# Altium schematic sheet NB2_DB.SchDoc
size A3
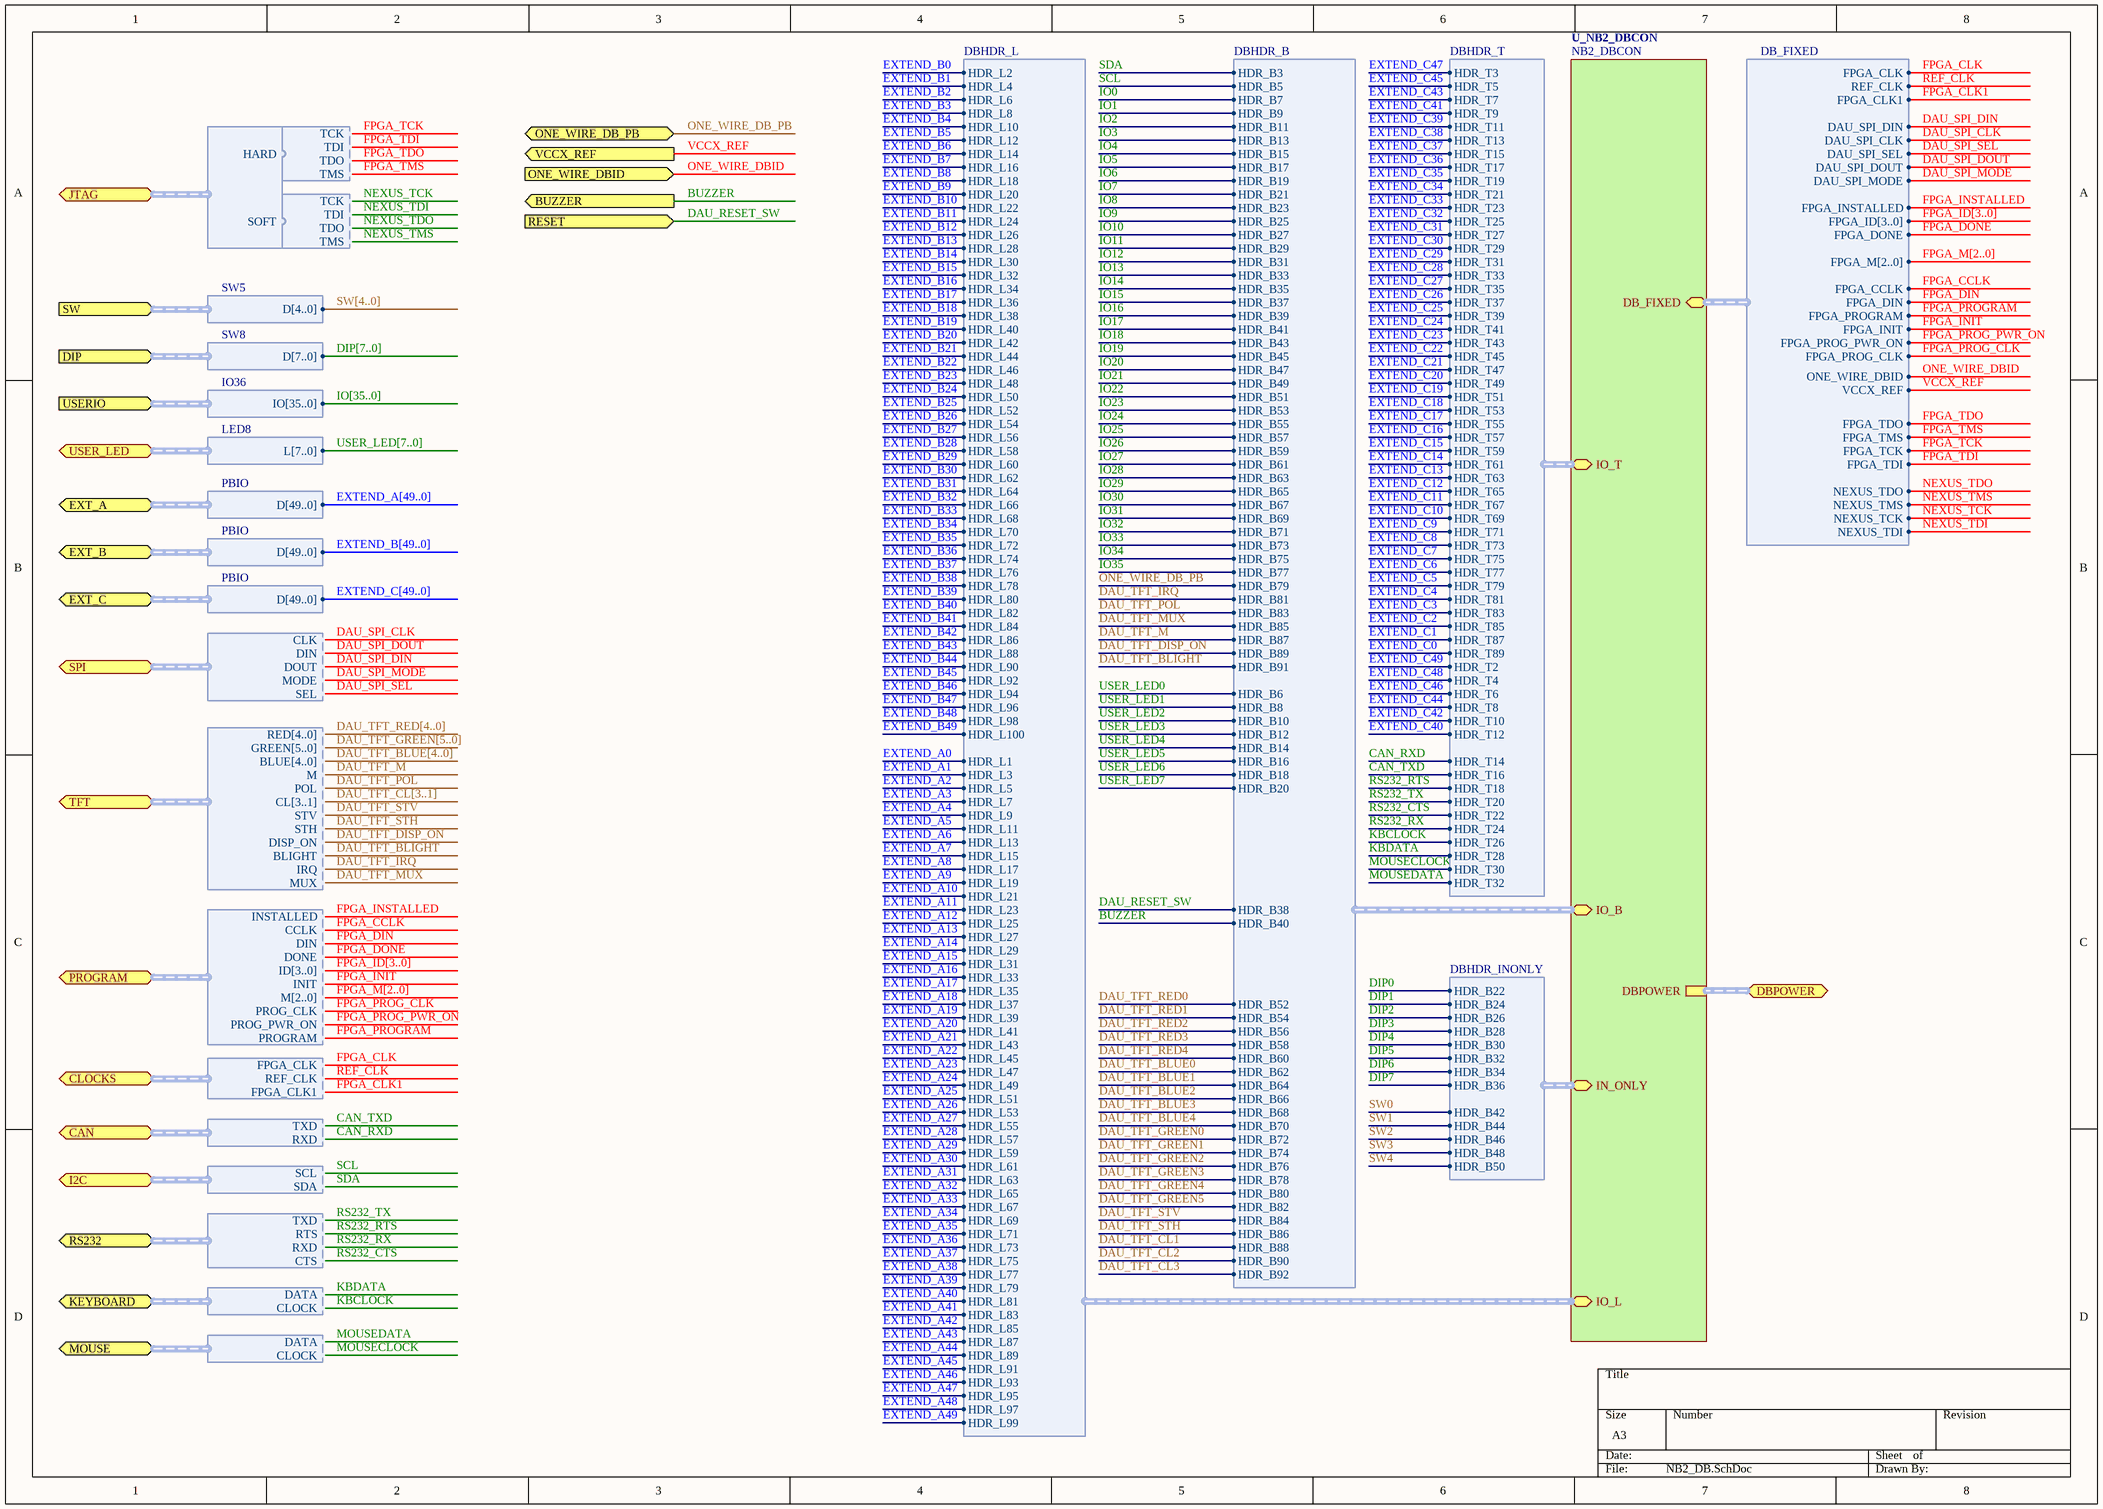
[diagram p0: NB2_DB.SchDoc]

## Sub-sheets
U_NB2_DBCON = NB2_DBCON: DBPOWER (harness DBPOWER), IO_B (harness DBHDR_B), DB_FIXED (harness DB_FIXED), IO_T (harness DBHDR_T), IN_ONLY (harness DBHDR_INONLY), IO_L (harness DBHDR_L)

## Ports
BUZZER (out), CAN (harness CAN_INT), CLOCKS (harness DAU_CLK), DBPOWER, DIP (harness SW8), EXT_A (harness PBIO), EXT_B (harness PBIO), EXT_C (harness PBIO), I2C (harness I2C), JTAG (harness HardSoft_JTAG), KEYBOARD (harness PS2), MOUSE (harness PS2), ONE_WIRE_DB_PB (bidir), ONE_WIRE_DBID (in), PROGRAM (harness DAU_CTRL), RESET (in), RS232 (harness RS232_INT), SPI (harness DAU_SPI), SW (harness SW5), TFT (harness DAU_TFT), USER_LED (harness LED8), USERIO (harness IO36), VCCX_REF (out)

## Harnesses
JTAG: TMS, TDO, TDI, TCK
HardSoft_JTAG: HARD, SOFT
LED8: L[7..0]
IO36: IO[35..0]
SW8: D[7..0]
SW5: D[4..0]
PBIO: D[49..0]
DAU_CLK: REF_CLK, FPGA_CLK, FPGA_CLK1
DAU_SPI: MODE, SEL, CLK, DIN, DOUT
DAU_CTRL: DIN, DONE, INSTALLED, ID[3..0], CCLK, PROGRAM, M[2..0], INIT, PROG_PWR_ON, PROG_CLK
DAU_TFT: RED[4..0], GREEN[5..0], BLUE[4..0], M, POL, CL[3..1], STV, STH, DISP_ON, BLIGHT, IRQ, MUX
PS2: DATA, CLOCK
CAN_INT: TXD, RXD
I2C: SCL, SDA
RS232_INT: RXD, TXD, RTS, CTS
DBHDR_B: HDR_B3, HDR_B5, HDR_B7, HDR_B9, HDR_B11, HDR_B13, HDR_B15, HDR_B17, HDR_B19, HDR_B21, HDR_B23, HDR_B25, HDR_B27, HDR_B29, HDR_B31, HDR_B33, HDR_B35, HDR_B37, HDR_B39, HDR_B41, HDR_B43, HDR_B45, HDR_B47, HDR_B49, HDR_B51, HDR_B53, HDR_B55, HDR_B57, HDR_B59, HDR_B61, HDR_B63, HDR_B65, HDR_B67, HDR_B69, HDR_B71, HDR_B73, HDR_B75, HDR_B77, HDR_B79, HDR_B81, HDR_B83, HDR_B85, HDR_B87, HDR_B89, HDR_B91, HDR_B6, HDR_B8, HDR_B10, HDR_B12, HDR_B14, HDR_B16, HDR_B18, HDR_B20, HDR_B38, HDR_B40, HDR_B52, HDR_B54, HDR_B56, HDR_B58, HDR_B60, HDR_B62, HDR_B64, HDR_B66, HDR_B68, HDR_B70, HDR_B72, HDR_B74, HDR_B76, HDR_B78, HDR_B80, HDR_B82, HDR_B84, HDR_B86, HDR_B88, HDR_B90, HDR_B92
DBHDR_T: HDR_T3, HDR_T5, HDR_T7, HDR_T9, HDR_T11, HDR_T13, HDR_T15, HDR_T17, HDR_T19, HDR_T21, HDR_T23, HDR_T25, HDR_T27, HDR_T29, HDR_T31, HDR_T33, HDR_T35, HDR_T37, HDR_T39, HDR_T41, HDR_T43, HDR_T45, HDR_T47, HDR_T49, HDR_T51, HDR_T53, HDR_T55, HDR_T57, HDR_T59, HDR_T61, HDR_T63, HDR_T65, HDR_T67, HDR_T69, HDR_T71, HDR_T73, HDR_T75, HDR_T77, HDR_T79, HDR_T81, HDR_T83, HDR_T85, HDR_T87, HDR_T89, HDR_T2, HDR_T4, HDR_T6, HDR_T8, HDR_T10, HDR_T12, HDR_T14, HDR_T16, HDR_T18, HDR_T20, HDR_T22, HDR_T24, HDR_T26, HDR_T28, HDR_T30, HDR_T32
DBHDR_L: HDR_L2, HDR_L4, HDR_L6, HDR_L8, HDR_L10, HDR_L12, HDR_L14, HDR_L16, HDR_L18, HDR_L20, HDR_L22, HDR_L24, HDR_L26, HDR_L28, HDR_L30, HDR_L32, HDR_L34, HDR_L36, HDR_L38, HDR_L40, HDR_L42, HDR_L44, HDR_L46, HDR_L48, HDR_L50, HDR_L52, HDR_L54, HDR_L56, HDR_L58, HDR_L60, HDR_L62, HDR_L64, HDR_L66, HDR_L68, HDR_L70, HDR_L72, HDR_L74, HDR_L76, HDR_L78, HDR_L80, HDR_L82, HDR_L84, HDR_L86, HDR_L88, HDR_L90, HDR_L92, HDR_L94, HDR_L96, HDR_L98, HDR_L100, HDR_L1, HDR_L3, HDR_L5, HDR_L7, HDR_L9, HDR_L11, HDR_L13, HDR_L15, HDR_L17, HDR_L19, HDR_L21, HDR_L23, HDR_L25, HDR_L27, HDR_L29, HDR_L31, HDR_L33, HDR_L35, HDR_L37, HDR_L39, HDR_L41, HDR_L43, HDR_L45, HDR_L47, HDR_L49, HDR_L51, HDR_L53, HDR_L55, HDR_L57, HDR_L59, HDR_L61, HDR_L63, HDR_L65, HDR_L67, HDR_L69, HDR_L71, HDR_L73, HDR_L75, HDR_L77, HDR_L79, HDR_L81, HDR_L83, HDR_L85, HDR_L87, HDR_L89, HDR_L91, HDR_L93, HDR_L95, HDR_L97, HDR_L99
DBHDR_INONLY: HDR_B22, HDR_B24, HDR_B26, HDR_B28, HDR_B30, HDR_B32, HDR_B34, HDR_B36, HDR_B42, HDR_B44, HDR_B46, HDR_B48, HDR_B50
DB_FIXED: DAU_SPI_CLK, DAU_SPI_DIN, DAU_SPI_DOUT, NEXUS_TMS, NEXUS_TDI, NEXUS_TDO, NEXUS_TCK, ONE_WIRE_DBID, FPGA_INSTALLED, FPGA_PROG_CLK, DAU_SPI_SEL, DAU_SPI_MODE, FPGA_PROG_PWR_ON, FPGA_DONE, FPGA_CCLK, FPGA_PROGRAM, FPGA_DIN, FPGA_INIT, FPGA_TDO, FPGA_TDI, FPGA_TCK, FPGA_TMS, FPGA_CLK1, FPGA_ID[3..0], FPGA_M[2..0], VCCX_REF, FPGA_CLK, REF_CLK

## Nets
BUZZER: port BUZZER, sheet U_NB2_DBCON/IO_B.HDR_B40
CAN_RXD: port CAN.RXD, sheet U_NB2_DBCON/IO_T.HDR_T14
CAN_TXD: port CAN.TXD, sheet U_NB2_DBCON/IO_T.HDR_T16
DAU_RESET_SW: port RESET, sheet U_NB2_DBCON/IO_B.HDR_B38
DAU_SPI_CLK: port SPI.CLK, sheet U_NB2_DBCON/DB_FIXED.DAU_SPI_CLK
DAU_SPI_DIN: port SPI.DOUT, sheet U_NB2_DBCON/DB_FIXED.DAU_SPI_DIN
DAU_SPI_DOUT: port SPI.DIN, sheet U_NB2_DBCON/DB_FIXED.DAU_SPI_DOUT
DAU_SPI_MODE: port SPI.MODE, sheet U_NB2_DBCON/DB_FIXED.DAU_SPI_MODE
DAU_SPI_SEL: port SPI.SEL, sheet U_NB2_DBCON/DB_FIXED.DAU_SPI_SEL
DAU_TFT_BLIGHT: port TFT.BLIGHT, sheet U_NB2_DBCON/IO_B.HDR_B91
DAU_TFT_BLUE0: sheet U_NB2_DBCON/IO_B.HDR_B62
DAU_TFT_BLUE1: sheet U_NB2_DBCON/IO_B.HDR_B64
DAU_TFT_BLUE2: sheet U_NB2_DBCON/IO_B.HDR_B66
DAU_TFT_BLUE3: sheet U_NB2_DBCON/IO_B.HDR_B68
DAU_TFT_BLUE4: sheet U_NB2_DBCON/IO_B.HDR_B70
DAU_TFT_CL1: sheet U_NB2_DBCON/IO_B.HDR_B88
DAU_TFT_CL2: sheet U_NB2_DBCON/IO_B.HDR_B90
DAU_TFT_CL3: sheet U_NB2_DBCON/IO_B.HDR_B92
DAU_TFT_DISP_ON: port TFT.DISP_ON, sheet U_NB2_DBCON/IO_B.HDR_B89
DAU_TFT_GREEN0: sheet U_NB2_DBCON/IO_B.HDR_B72
DAU_TFT_GREEN1: sheet U_NB2_DBCON/IO_B.HDR_B74
DAU_TFT_GREEN2: sheet U_NB2_DBCON/IO_B.HDR_B76
DAU_TFT_GREEN3: sheet U_NB2_DBCON/IO_B.HDR_B78
DAU_TFT_GREEN4: sheet U_NB2_DBCON/IO_B.HDR_B80
DAU_TFT_GREEN5: sheet U_NB2_DBCON/IO_B.HDR_B82
DAU_TFT_IRQ: port TFT.IRQ, sheet U_NB2_DBCON/IO_B.HDR_B81
DAU_TFT_M: port TFT.M, sheet U_NB2_DBCON/IO_B.HDR_B87
DAU_TFT_MUX: port TFT.MUX, sheet U_NB2_DBCON/IO_B.HDR_B85
DAU_TFT_POL: port TFT.POL, sheet U_NB2_DBCON/IO_B.HDR_B83
DAU_TFT_RED0: sheet U_NB2_DBCON/IO_B.HDR_B52
DAU_TFT_RED1: sheet U_NB2_DBCON/IO_B.HDR_B54
DAU_TFT_RED2: sheet U_NB2_DBCON/IO_B.HDR_B56
DAU_TFT_RED3: sheet U_NB2_DBCON/IO_B.HDR_B58
DAU_TFT_RED4: sheet U_NB2_DBCON/IO_B.HDR_B60
DAU_TFT_STH: port TFT.STH, sheet U_NB2_DBCON/IO_B.HDR_B86
DAU_TFT_STV: port TFT.STV, sheet U_NB2_DBCON/IO_B.HDR_B84
DIP0: sheet U_NB2_DBCON/IN_ONLY.HDR_B22
DIP1: sheet U_NB2_DBCON/IN_ONLY.HDR_B24
DIP2: sheet U_NB2_DBCON/IN_ONLY.HDR_B26
DIP3: sheet U_NB2_DBCON/IN_ONLY.HDR_B28
DIP4: sheet U_NB2_DBCON/IN_ONLY.HDR_B30
DIP5: sheet U_NB2_DBCON/IN_ONLY.HDR_B32
DIP6: sheet U_NB2_DBCON/IN_ONLY.HDR_B34
DIP7: sheet U_NB2_DBCON/IN_ONLY.HDR_B36
EXTEND_A0: sheet U_NB2_DBCON/IO_L.HDR_L1
EXTEND_A1: sheet U_NB2_DBCON/IO_L.HDR_L3
EXTEND_A2: sheet U_NB2_DBCON/IO_L.HDR_L5
EXTEND_A3: sheet U_NB2_DBCON/IO_L.HDR_L7
EXTEND_A4: sheet U_NB2_DBCON/IO_L.HDR_L9
EXTEND_A5: sheet U_NB2_DBCON/IO_L.HDR_L11
EXTEND_A6: sheet U_NB2_DBCON/IO_L.HDR_L13
EXTEND_A7: sheet U_NB2_DBCON/IO_L.HDR_L15
EXTEND_A8: sheet U_NB2_DBCON/IO_L.HDR_L17
EXTEND_A9: sheet U_NB2_DBCON/IO_L.HDR_L19
EXTEND_A10: sheet U_NB2_DBCON/IO_L.HDR_L21
EXTEND_A11: sheet U_NB2_DBCON/IO_L.HDR_L23
EXTEND_A12: sheet U_NB2_DBCON/IO_L.HDR_L25
EXTEND_A13: sheet U_NB2_DBCON/IO_L.HDR_L27
EXTEND_A14: sheet U_NB2_DBCON/IO_L.HDR_L29
EXTEND_A15: sheet U_NB2_DBCON/IO_L.HDR_L31
EXTEND_A16: sheet U_NB2_DBCON/IO_L.HDR_L33
EXTEND_A17: sheet U_NB2_DBCON/IO_L.HDR_L35
EXTEND_A18: sheet U_NB2_DBCON/IO_L.HDR_L37
EXTEND_A19: sheet U_NB2_DBCON/IO_L.HDR_L39
EXTEND_A20: sheet U_NB2_DBCON/IO_L.HDR_L41
EXTEND_A21: sheet U_NB2_DBCON/IO_L.HDR_L43
EXTEND_A22: sheet U_NB2_DBCON/IO_L.HDR_L45
EXTEND_A23: sheet U_NB2_DBCON/IO_L.HDR_L47
EXTEND_A24: sheet U_NB2_DBCON/IO_L.HDR_L49
EXTEND_A25: sheet U_NB2_DBCON/IO_L.HDR_L51
EXTEND_A26: sheet U_NB2_DBCON/IO_L.HDR_L53
EXTEND_A27: sheet U_NB2_DBCON/IO_L.HDR_L55
EXTEND_A28: sheet U_NB2_DBCON/IO_L.HDR_L57
EXTEND_A29: sheet U_NB2_DBCON/IO_L.HDR_L59
EXTEND_A30: sheet U_NB2_DBCON/IO_L.HDR_L61
EXTEND_A31: sheet U_NB2_DBCON/IO_L.HDR_L63
EXTEND_A32: sheet U_NB2_DBCON/IO_L.HDR_L65
EXTEND_A33: sheet U_NB2_DBCON/IO_L.HDR_L67
EXTEND_A34: sheet U_NB2_DBCON/IO_L.HDR_L69
EXTEND_A35: sheet U_NB2_DBCON/IO_L.HDR_L71
EXTEND_A36: sheet U_NB2_DBCON/IO_L.HDR_L73
EXTEND_A37: sheet U_NB2_DBCON/IO_L.HDR_L75
EXTEND_A38: sheet U_NB2_DBCON/IO_L.HDR_L77
EXTEND_A39: sheet U_NB2_DBCON/IO_L.HDR_L79
EXTEND_A40: sheet U_NB2_DBCON/IO_L.HDR_L81
EXTEND_A41: sheet U_NB2_DBCON/IO_L.HDR_L83
EXTEND_A42: sheet U_NB2_DBCON/IO_L.HDR_L85
EXTEND_A43: sheet U_NB2_DBCON/IO_L.HDR_L87
EXTEND_A44: sheet U_NB2_DBCON/IO_L.HDR_L89
EXTEND_A45: sheet U_NB2_DBCON/IO_L.HDR_L91
EXTEND_A46: sheet U_NB2_DBCON/IO_L.HDR_L93
EXTEND_A47: sheet U_NB2_DBCON/IO_L.HDR_L95
EXTEND_A48: sheet U_NB2_DBCON/IO_L.HDR_L97
EXTEND_A49: sheet U_NB2_DBCON/IO_L.HDR_L99
EXTEND_B0: sheet U_NB2_DBCON/IO_L.HDR_L2
EXTEND_B1: sheet U_NB2_DBCON/IO_L.HDR_L4
EXTEND_B2: sheet U_NB2_DBCON/IO_L.HDR_L6
EXTEND_B3: sheet U_NB2_DBCON/IO_L.HDR_L8
EXTEND_B4: sheet U_NB2_DBCON/IO_L.HDR_L10
EXTEND_B5: sheet U_NB2_DBCON/IO_L.HDR_L12
EXTEND_B6: sheet U_NB2_DBCON/IO_L.HDR_L14
EXTEND_B7: sheet U_NB2_DBCON/IO_L.HDR_L16
EXTEND_B8: sheet U_NB2_DBCON/IO_L.HDR_L18
EXTEND_B9: sheet U_NB2_DBCON/IO_L.HDR_L20
EXTEND_B10: sheet U_NB2_DBCON/IO_L.HDR_L22
EXTEND_B11: sheet U_NB2_DBCON/IO_L.HDR_L24
EXTEND_B12: sheet U_NB2_DBCON/IO_L.HDR_L26
EXTEND_B13: sheet U_NB2_DBCON/IO_L.HDR_L28
EXTEND_B14: sheet U_NB2_DBCON/IO_L.HDR_L30
EXTEND_B15: sheet U_NB2_DBCON/IO_L.HDR_L32
EXTEND_B16: sheet U_NB2_DBCON/IO_L.HDR_L34
EXTEND_B17: sheet U_NB2_DBCON/IO_L.HDR_L36
EXTEND_B18: sheet U_NB2_DBCON/IO_L.HDR_L38
EXTEND_B19: sheet U_NB2_DBCON/IO_L.HDR_L40
EXTEND_B20: sheet U_NB2_DBCON/IO_L.HDR_L42
EXTEND_B21: sheet U_NB2_DBCON/IO_L.HDR_L44
EXTEND_B22: sheet U_NB2_DBCON/IO_L.HDR_L46
EXTEND_B23: sheet U_NB2_DBCON/IO_L.HDR_L48
EXTEND_B24: sheet U_NB2_DBCON/IO_L.HDR_L50
EXTEND_B25: sheet U_NB2_DBCON/IO_L.HDR_L52
EXTEND_B26: sheet U_NB2_DBCON/IO_L.HDR_L54
EXTEND_B27: sheet U_NB2_DBCON/IO_L.HDR_L56
EXTEND_B28: sheet U_NB2_DBCON/IO_L.HDR_L58
EXTEND_B29: sheet U_NB2_DBCON/IO_L.HDR_L60
EXTEND_B30: sheet U_NB2_DBCON/IO_L.HDR_L62
EXTEND_B31: sheet U_NB2_DBCON/IO_L.HDR_L64
EXTEND_B32: sheet U_NB2_DBCON/IO_L.HDR_L66
EXTEND_B33: sheet U_NB2_DBCON/IO_L.HDR_L68
EXTEND_B34: sheet U_NB2_DBCON/IO_L.HDR_L70
EXTEND_B35: sheet U_NB2_DBCON/IO_L.HDR_L72
EXTEND_B36: sheet U_NB2_DBCON/IO_L.HDR_L74
EXTEND_B37: sheet U_NB2_DBCON/IO_L.HDR_L76
EXTEND_B38: sheet U_NB2_DBCON/IO_L.HDR_L78
EXTEND_B39: sheet U_NB2_DBCON/IO_L.HDR_L80
EXTEND_B40: sheet U_NB2_DBCON/IO_L.HDR_L82
EXTEND_B41: sheet U_NB2_DBCON/IO_L.HDR_L84
EXTEND_B42: sheet U_NB2_DBCON/IO_L.HDR_L86
EXTEND_B43: sheet U_NB2_DBCON/IO_L.HDR_L88
EXTEND_B44: sheet U_NB2_DBCON/IO_L.HDR_L90
EXTEND_B45: sheet U_NB2_DBCON/IO_L.HDR_L92
EXTEND_B46: sheet U_NB2_DBCON/IO_L.HDR_L94
EXTEND_B47: sheet U_NB2_DBCON/IO_L.HDR_L96
EXTEND_B48: sheet U_NB2_DBCON/IO_L.HDR_L98
EXTEND_B49: sheet U_NB2_DBCON/IO_L.HDR_L100
EXTEND_C0: sheet U_NB2_DBCON/IO_T.HDR_T89
EXTEND_C1: sheet U_NB2_DBCON/IO_T.HDR_T87
EXTEND_C2: sheet U_NB2_DBCON/IO_T.HDR_T85
EXTEND_C3: sheet U_NB2_DBCON/IO_T.HDR_T83
EXTEND_C4: sheet U_NB2_DBCON/IO_T.HDR_T81
EXTEND_C5: sheet U_NB2_DBCON/IO_T.HDR_T79
EXTEND_C6: sheet U_NB2_DBCON/IO_T.HDR_T77
EXTEND_C7: sheet U_NB2_DBCON/IO_T.HDR_T75
EXTEND_C8: sheet U_NB2_DBCON/IO_T.HDR_T73
EXTEND_C9: sheet U_NB2_DBCON/IO_T.HDR_T71
EXTEND_C10: sheet U_NB2_DBCON/IO_T.HDR_T69
EXTEND_C11: sheet U_NB2_DBCON/IO_T.HDR_T67
EXTEND_C12: sheet U_NB2_DBCON/IO_T.HDR_T65
EXTEND_C13: sheet U_NB2_DBCON/IO_T.HDR_T63
EXTEND_C14: sheet U_NB2_DBCON/IO_T.HDR_T61
EXTEND_C15: sheet U_NB2_DBCON/IO_T.HDR_T59
EXTEND_C16: sheet U_NB2_DBCON/IO_T.HDR_T57
EXTEND_C17: sheet U_NB2_DBCON/IO_T.HDR_T55
EXTEND_C18: sheet U_NB2_DBCON/IO_T.HDR_T53
EXTEND_C19: sheet U_NB2_DBCON/IO_T.HDR_T51
EXTEND_C20: sheet U_NB2_DBCON/IO_T.HDR_T49
EXTEND_C21: sheet U_NB2_DBCON/IO_T.HDR_T47
EXTEND_C22: sheet U_NB2_DBCON/IO_T.HDR_T45
EXTEND_C23: sheet U_NB2_DBCON/IO_T.HDR_T43
EXTEND_C24: sheet U_NB2_DBCON/IO_T.HDR_T41
EXTEND_C25: sheet U_NB2_DBCON/IO_T.HDR_T39
EXTEND_C26: sheet U_NB2_DBCON/IO_T.HDR_T37
EXTEND_C27: sheet U_NB2_DBCON/IO_T.HDR_T35
EXTEND_C28: sheet U_NB2_DBCON/IO_T.HDR_T33
EXTEND_C29: sheet U_NB2_DBCON/IO_T.HDR_T31
EXTEND_C30: sheet U_NB2_DBCON/IO_T.HDR_T29
EXTEND_C31: sheet U_NB2_DBCON/IO_T.HDR_T27
EXTEND_C32: sheet U_NB2_DBCON/IO_T.HDR_T25
EXTEND_C33: sheet U_NB2_DBCON/IO_T.HDR_T23
EXTEND_C34: sheet U_NB2_DBCON/IO_T.HDR_T21
EXTEND_C35: sheet U_NB2_DBCON/IO_T.HDR_T19
EXTEND_C36: sheet U_NB2_DBCON/IO_T.HDR_T17
EXTEND_C37: sheet U_NB2_DBCON/IO_T.HDR_T15
EXTEND_C38: sheet U_NB2_DBCON/IO_T.HDR_T13
EXTEND_C39: sheet U_NB2_DBCON/IO_T.HDR_T11
EXTEND_C40: sheet U_NB2_DBCON/IO_T.HDR_T12
EXTEND_C41: sheet U_NB2_DBCON/IO_T.HDR_T9
EXTEND_C42: sheet U_NB2_DBCON/IO_T.HDR_T10
EXTEND_C43: sheet U_NB2_DBCON/IO_T.HDR_T7
EXTEND_C44: sheet U_NB2_DBCON/IO_T.HDR_T8
EXTEND_C45: sheet U_NB2_DBCON/IO_T.HDR_T5
EXTEND_C46: sheet U_NB2_DBCON/IO_T.HDR_T6
EXTEND_C47: sheet U_NB2_DBCON/IO_T.HDR_T3
EXTEND_C48: sheet U_NB2_DBCON/IO_T.HDR_T4
EXTEND_C49: sheet U_NB2_DBCON/IO_T.HDR_T2
FPGA_CCLK: port PROGRAM.CCLK, sheet U_NB2_DBCON/DB_FIXED.FPGA_CCLK
FPGA_CLK: port CLOCKS.FPGA_CLK, sheet U_NB2_DBCON/DB_FIXED.FPGA_CLK
FPGA_CLK1: port CLOCKS.FPGA_CLK1, sheet U_NB2_DBCON/DB_FIXED.FPGA_CLK1
FPGA_DIN: port PROGRAM.DIN, sheet U_NB2_DBCON/DB_FIXED.FPGA_DIN
FPGA_DONE: port PROGRAM.DONE, sheet U_NB2_DBCON/DB_FIXED.FPGA_DONE
FPGA_INIT: port PROGRAM.INIT, sheet U_NB2_DBCON/DB_FIXED.FPGA_INIT
FPGA_INSTALLED: port PROGRAM.INSTALLED, sheet U_NB2_DBCON/DB_FIXED.FPGA_INSTALLED
FPGA_PROG_CLK: port PROGRAM.PROG_CLK, sheet U_NB2_DBCON/DB_FIXED.FPGA_PROG_CLK
FPGA_PROG_PWR_ON: port PROGRAM.PROG_PWR_ON, sheet U_NB2_DBCON/DB_FIXED.FPGA_PROG_PWR_ON
FPGA_PROGRAM: port PROGRAM.PROGRAM, sheet U_NB2_DBCON/DB_FIXED.FPGA_PROGRAM
FPGA_TCK: harness JTAG.TCK, sheet U_NB2_DBCON/DB_FIXED.FPGA_TCK
FPGA_TDI: harness JTAG.TDI, sheet U_NB2_DBCON/DB_FIXED.FPGA_TDI
FPGA_TDO: harness JTAG.TDO, sheet U_NB2_DBCON/DB_FIXED.FPGA_TDO
FPGA_TMS: harness JTAG.TMS, sheet U_NB2_DBCON/DB_FIXED.FPGA_TMS
IO0: sheet U_NB2_DBCON/IO_B.HDR_B7
IO1: sheet U_NB2_DBCON/IO_B.HDR_B9
IO2: sheet U_NB2_DBCON/IO_B.HDR_B11
IO3: sheet U_NB2_DBCON/IO_B.HDR_B13
IO4: sheet U_NB2_DBCON/IO_B.HDR_B15
IO5: sheet U_NB2_DBCON/IO_B.HDR_B17
IO6: sheet U_NB2_DBCON/IO_B.HDR_B19
IO7: sheet U_NB2_DBCON/IO_B.HDR_B21
IO8: sheet U_NB2_DBCON/IO_B.HDR_B23
IO9: sheet U_NB2_DBCON/IO_B.HDR_B25
IO10: sheet U_NB2_DBCON/IO_B.HDR_B27
IO11: sheet U_NB2_DBCON/IO_B.HDR_B29
IO12: sheet U_NB2_DBCON/IO_B.HDR_B31
IO13: sheet U_NB2_DBCON/IO_B.HDR_B33
IO14: sheet U_NB2_DBCON/IO_B.HDR_B35
IO15: sheet U_NB2_DBCON/IO_B.HDR_B37
IO16: sheet U_NB2_DBCON/IO_B.HDR_B39
IO17: sheet U_NB2_DBCON/IO_B.HDR_B41
IO18: sheet U_NB2_DBCON/IO_B.HDR_B43
IO19: sheet U_NB2_DBCON/IO_B.HDR_B45
IO20: sheet U_NB2_DBCON/IO_B.HDR_B47
IO21: sheet U_NB2_DBCON/IO_B.HDR_B49
IO22: sheet U_NB2_DBCON/IO_B.HDR_B51
IO23: sheet U_NB2_DBCON/IO_B.HDR_B53
IO24: sheet U_NB2_DBCON/IO_B.HDR_B55
IO25: sheet U_NB2_DBCON/IO_B.HDR_B57
IO26: sheet U_NB2_DBCON/IO_B.HDR_B59
IO27: sheet U_NB2_DBCON/IO_B.HDR_B61
IO28: sheet U_NB2_DBCON/IO_B.HDR_B63
IO29: sheet U_NB2_DBCON/IO_B.HDR_B65
IO30: sheet U_NB2_DBCON/IO_B.HDR_B67
IO31: sheet U_NB2_DBCON/IO_B.HDR_B69
IO32: sheet U_NB2_DBCON/IO_B.HDR_B71
IO33: sheet U_NB2_DBCON/IO_B.HDR_B73
IO34: sheet U_NB2_DBCON/IO_B.HDR_B75
IO35: sheet U_NB2_DBCON/IO_B.HDR_B77
KBCLOCK: port KEYBOARD.CLOCK, sheet U_NB2_DBCON/IO_T.HDR_T26
KBDATA: port KEYBOARD.DATA, sheet U_NB2_DBCON/IO_T.HDR_T28
MOUSECLOCK: port MOUSE.CLOCK, sheet U_NB2_DBCON/IO_T.HDR_T30
MOUSEDATA: port MOUSE.DATA, sheet U_NB2_DBCON/IO_T.HDR_T32
NEXUS_TCK: harness JTAG.TCK, sheet U_NB2_DBCON/DB_FIXED.NEXUS_TCK
NEXUS_TDI: harness JTAG.TDI, sheet U_NB2_DBCON/DB_FIXED.NEXUS_TDI
NEXUS_TDO: harness JTAG.TDO, sheet U_NB2_DBCON/DB_FIXED.NEXUS_TDO
NEXUS_TMS: harness JTAG.TMS, sheet U_NB2_DBCON/DB_FIXED.NEXUS_TMS
ONE_WIRE_DB_PB: port ONE_WIRE_DB_PB, sheet U_NB2_DBCON/IO_B.HDR_B79
ONE_WIRE_DBID: port ONE_WIRE_DBID, sheet U_NB2_DBCON/DB_FIXED.ONE_WIRE_DBID
REF_CLK: port CLOCKS.REF_CLK, sheet U_NB2_DBCON/DB_FIXED.REF_CLK
RS232_CTS: port RS232.CTS, sheet U_NB2_DBCON/IO_T.HDR_T22
RS232_RTS: port RS232.RTS, sheet U_NB2_DBCON/IO_T.HDR_T18
RS232_RX: port RS232.RXD, sheet U_NB2_DBCON/IO_T.HDR_T24
RS232_TX: port RS232.TXD, sheet U_NB2_DBCON/IO_T.HDR_T20
SCL: port I2C.SCL, sheet U_NB2_DBCON/IO_B.HDR_B5
SDA: port I2C.SDA, sheet U_NB2_DBCON/IO_B.HDR_B3
SW0: sheet U_NB2_DBCON/IN_ONLY.HDR_B42
SW1: sheet U_NB2_DBCON/IN_ONLY.HDR_B44
SW2: sheet U_NB2_DBCON/IN_ONLY.HDR_B46
SW3: sheet U_NB2_DBCON/IN_ONLY.HDR_B48
SW4: sheet U_NB2_DBCON/IN_ONLY.HDR_B50
USER_LED0: sheet U_NB2_DBCON/IO_B.HDR_B6
USER_LED1: sheet U_NB2_DBCON/IO_B.HDR_B8
USER_LED2: sheet U_NB2_DBCON/IO_B.HDR_B10
USER_LED3: sheet U_NB2_DBCON/IO_B.HDR_B12
USER_LED4: sheet U_NB2_DBCON/IO_B.HDR_B14
USER_LED5: sheet U_NB2_DBCON/IO_B.HDR_B16
USER_LED6: sheet U_NB2_DBCON/IO_B.HDR_B18
USER_LED7: sheet U_NB2_DBCON/IO_B.HDR_B20
VCCX_REF: port VCCX_REF, sheet U_NB2_DBCON/DB_FIXED.VCCX_REF

## Buses and harness runs
bus DAU_TFT_BLUE[4..0]
bus DAU_TFT_CL[3..1]
bus DAU_TFT_GREEN[5..0]
bus DAU_TFT_RED[4..0]
bus DIP[7..0]
bus EXTEND_A[49..0]
bus EXTEND_B[49..0]
bus EXTEND_C[49..0]
bus FPGA_ID[3..0]
bus FPGA_M[2..0]
bus IO[35..0]
bus SW[4..0]
bus USER_LED[7..0]
harness port DBPOWER = sheet U_NB2_DBCON/DBPOWER